# EAGLE design ENGR12L Security Alarm v2 (EAGLE 7.5.0)
DESIGNBY: Jonathan Hull; TITLE: ENGR12L Security Alarm
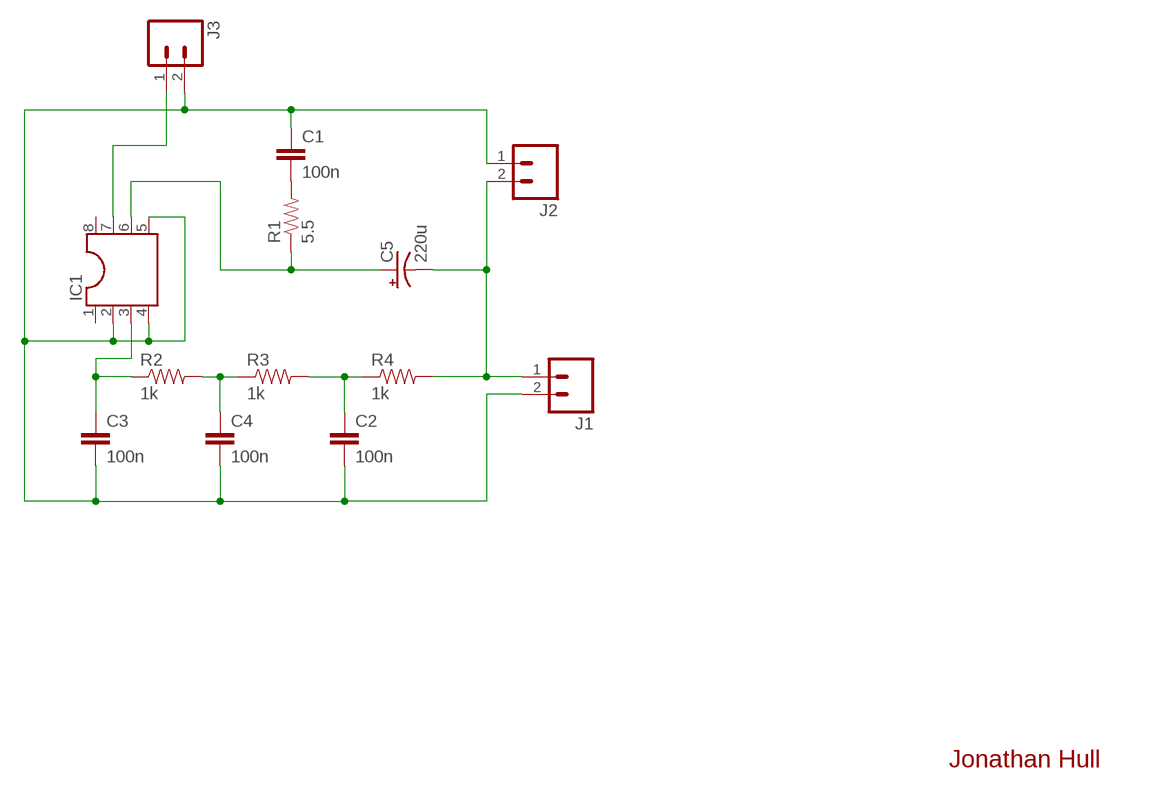
[diagram p0: schematic, sheet 1]

## Parts
C1  100n  CAPPTH  [CAP-PTH-SMALL]
C2  100n  CAPPTH  [CAP-PTH-SMALL]
C3  100n  CAPPTH  [CAP-PTH-SMALL]
C4  100n  CAPPTH  [CAP-PTH-SMALL]
C5  220u  CAP_POLPTH2  [CPOL-RADIAL-10UF-25V]
IC1  DIL8S  [SOCKET-08]
J1  M023.5MM  [SCREWTERMINAL-3.5MM-2]
J2  M023.5MM  [SCREWTERMINAL-3.5MM-2]
J3  M023.5MM  [SCREWTERMINAL-3.5MM-2]
R1  5.5  RESISTORPTH-1/4W  [AXIAL-0.4]
R2  1k  RESISTORPTH-1/4W  [AXIAL-0.4]
R3  1k  RESISTORPTH-1/4W  [AXIAL-0.4]
R4  1k  RESISTORPTH-1/4W  [AXIAL-0.4]

## Nets
GND: C1.1 C2.2 C3.2 C4.2 IC1.2 IC1.4 IC1.5 J1.2 J2.1 J3.2
N$1: C1.2 R1.P$2
N$2: IC1.7 J3.1
N$3: C4.1 R2.P$2 R3.P$1
N$4: C2.1 R3.P$2 R4.P$1
N$5: C3.1 IC1.3 R2.P$1
N$6: C5.2(-) J1.1 J2.2 R4.P$2
N$8: C5.1(+) IC1.6 R1.P$1
Unconnected: IC1.1 IC1.8

## Notes on the sheet
- Jonathan Hull

## Library data of the parts
C1-C4 = SparkFun-Capacitors:CAP: Capacitor Standard 0603 ceramic capacitor, and 0.1" leaded capacitor.
C5 = SparkFun-Capacitors:CAP_POL: Capacitor Polarized These are standard SMD and PTH capacitors. Normally 10uF, 47uF, and 100uF in electrolytic and tantalum varieties. Always verify the external diameter of the through hole cap, it varies with capacity, voltage, and manufacturer. The EIA devices should be standard.
IC1 = ic-package:DIL8: Dual In Line / Socket
J1-J3 = SparkFun-Connectors:M02: Standard 2-pin 0.1" header. Use with - straight break away headers ( PRT-00116) - right angle break away headers (PRT-00553) - swiss pins (PRT-00743) - machine pins (PRT-00117) - female headers (PRT-00115) Molex polarized connector foot print use with: PRT-08233 with associated crimp pins and housings. 2.54_SCREWTERM for use with PRT-10571. 3.5mm Screw Terminal footprints for PRT-08084 5mm Screw Terminal footprints for use with PRT-08432; PROD_ID: CONN-08399
R1-R4 = SparkFun-Passives:RESISTOR: Resistor Basic schematic elements and footprints for 0603, 1206, and PTH resistors.

## Net classes
0 default: width 0.254 mm, clearance 0.508 mm

## Board
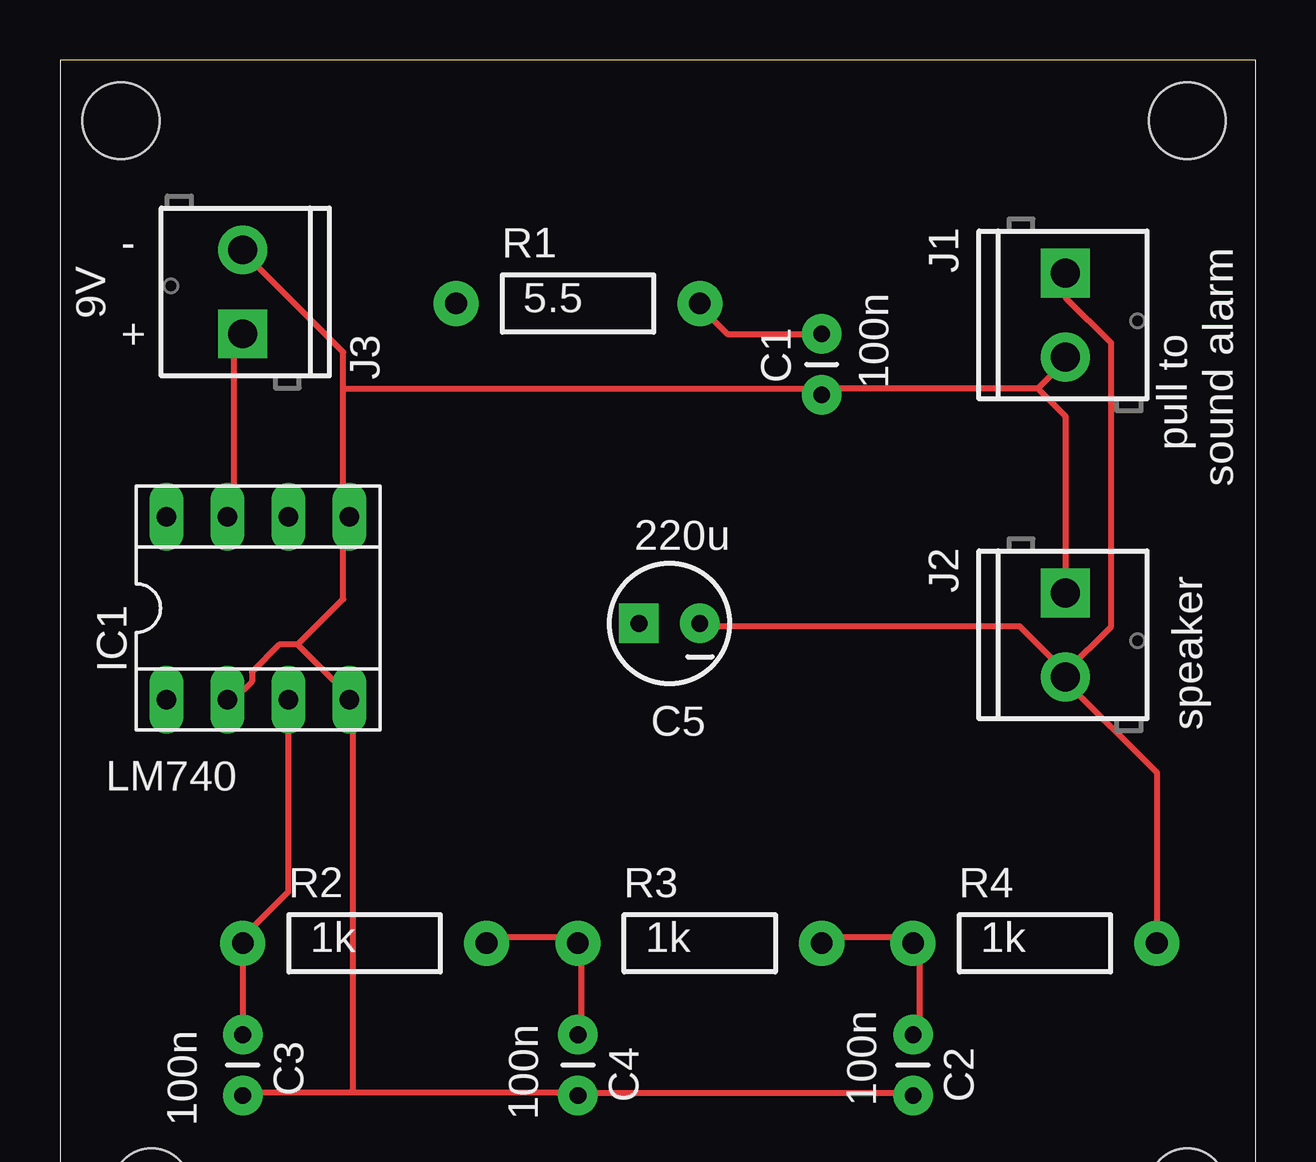
[diagram p1: board, top side]
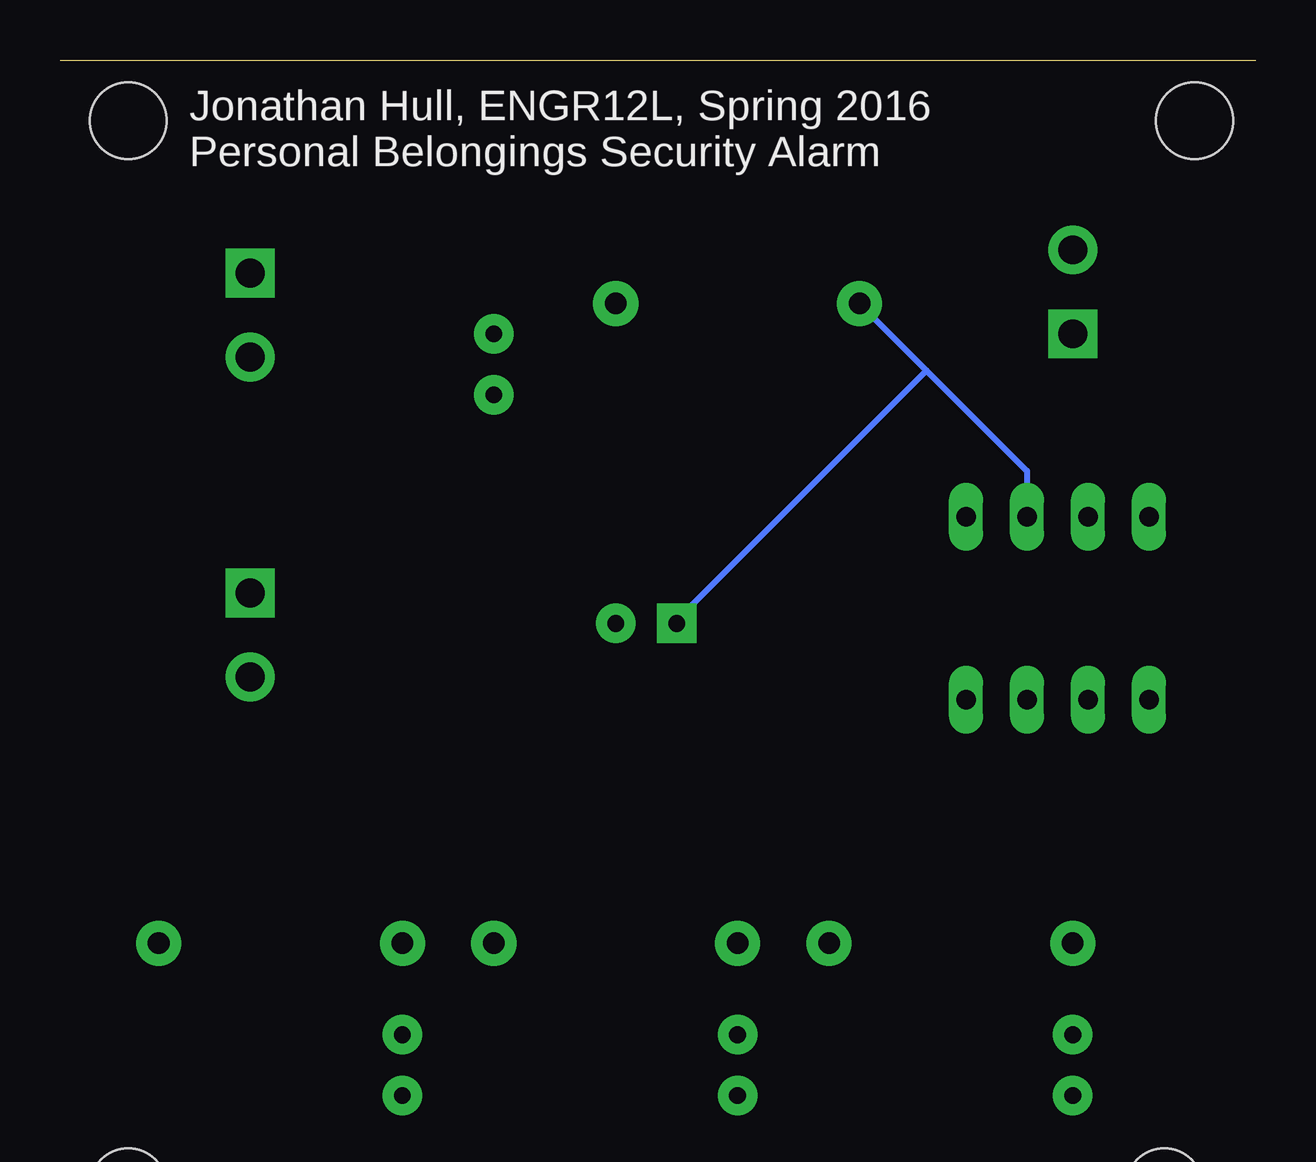
[diagram p2: board, bottom side, seen from below]

Size 49.84 x 0 mm. Coordinates in mm from the lower left corner, seen from the top.
Outline: 49.84,0 0,0
Copper layers (1*16): Top 0.035mm / dielectric 1.5mm / Bottom 0.035mm
Design rules "SparkFun": minimum track width 8mil, minimum drill 20mil, track to track 8mil, track to pad 8mil, pad to pad 8mil, via to via 8mil, smd to smd 8mil, copper to edge 10mil, drill to drill 8mil, minimum pad ring 12mil, minimum via ring 10mil, stop-mask expansion 4mil, vias tented up to drill 25mil, thermal gap 10mil
Holes 3.2 mm at 3.81,-46.98 46.99,-46.98 2.54,-2.53 46.99,-2.53

### Footprints (pad centres in the part's own frame; a part is rotated, then mirrored left to right if it is on the bottom)
CAP-PTH-SMALL = drill 0.7 pad 1.651: 1 0,0; 2 2.54,0
CPOL-RADIAL-10UF-25V = drill 0.7 pad 1.651 square: 1 1.27,0 | drill 0.7 pad 1.651: 2 -1.27,0
SOCKET-08 = drill 0.813 long: 1 -3.81,-3.81; 2 -1.27,-3.81; 3 1.27,-3.81; 4 3.81,-3.81; 5 3.81,3.81; 6 1.27,3.81; 7 -1.27,3.81; 8 -3.81,3.81
SCREWTERMINAL-3.5MM-2 = drill 1.2 pad 2.032 square: 1 0,0 | drill 1.2 pad 2.032: 2 3.5,0
AXIAL-0.4 = drill 0.9 pad 1.88: P$1 -5.08,0; P$2 5.08,0

### Placement (x,y rotation side)
C1  31.75,-13.96 90 top  (outside the outline)
C2  35.56,-40.63 270 top  (outside the outline)
C3  7.62,-40.63 270 top  (outside the outline)
C4  21.59,-40.63 270 top  (outside the outline)
C5  25.4,-23.49 180 top  (outside the outline)
IC1  8.26,-22.85 0 top  (outside the outline)
J1  41.91,-8.88 270 top  (outside the outline)
J2  41.91,-22.22 270 top  (outside the outline)
J3  7.62,-11.42 90 top  (outside the outline)
R1  21.59,-10.15 0 top  (outside the outline)
R2  12.7,-36.82 0 top  (outside the outline)
R3  26.67,-36.82 0 top  (outside the outline)
R4  40.64,-36.82 0 top  (outside the outline)

### Tracks (layer width: path | path; a pad name or v marks a point on that pad's centre or on a via)
GND
  Top 0.254: 12.19,-43.04 21.34,-43.04 C4.2 21.72,-43.04 35.43,-43.04 C2.2 | 12.19,-43.04 7.62,-43.04 C3.2 | 40.77,-13.71 32,-13.71 C1.1 31.62,-13.71 11.81,-13.71 | 40.77,-13.71 41.91,-12.56 J1.2 | J2.1 41.91,-14.85 40.77,-13.71 | 9.91,-24.37 9.14,-24.37 8,-25.52 8,-25.9 7.24,-26.66 IC1.2 | 12.19,-26.66 9.91,-24.37 | 11.81,-19.04 11.81,-22.47 9.91,-24.37 | 11.81,-19.04 11.81,-13.71 | 11.81,-13.71 11.81,-12.18 7.62,-7.99 J3.2 | 11.81,-19.04 IC1.5 | 12.19,-26.66 12.19,-43.04 | 12.19,-26.66 IC1.4
N$1
  Top 0.254: C1.2 27.81,-11.42 26.67,-10.28 R1.P$2
N$2
  Top 0.254: J3.1 7.24,-11.8 7.24,-19.04 IC1.7
N$3
  Top 0.254: C4.1 21.72,-40.38 21.72,-36.95 R3.P$1 21.34,-36.57 17.91,-36.57 R2.P$2
N$4
  Top 0.254: C2.1 35.81,-40.38 35.81,-36.95 R4.P$1 35.43,-36.57 32,-36.57 R3.P$2
N$5
  Top 0.254: IC1.3 9.53,-34.66 7.62,-36.57 R2.P$1 C3.1
N$6
  Top 0.254: 41.91,-25.52 40.01,-23.61 26.67,-23.61 C5.2 | R4.P$2 45.72,-29.71 41.91,-25.9 J2.2 41.91,-25.52 | J1.1 41.91,-9.9 43.81,-11.8 43.81,-23.61 41.91,-25.52
N$8
  Bottom 0.254: IC1.6 9.53,-17.14 13.72,-12.94 | R1.P$1 13.72,-12.94 | 13.72,-12.94 24,-23.23 C5.1

### Text on the board
tPlace: - | 9V | + | pull to / sound alarm | speaker | LM740 | C3 | 100n
bPlace: Jonathan Hull, ENGR12L, Spring 2016 / Personal Belongings Security Alarm